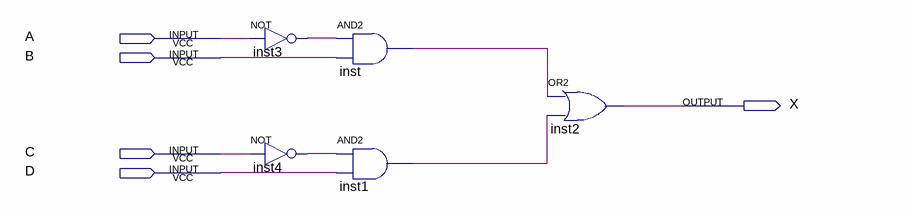
[diagram p0: schematic sheet]
// Quartus schematic Boolean2.bdf as structural Verilog: 5 symbols, 5 pins
module Boolean2 (
  input  A,
  input  B,
  input  C,
  input  D,
  output X
);

  wire inst1_out, inst3_out, inst4_out, inst_out;

  not inst3 (inst3_out, A);
  not inst4 (inst4_out, C);
  and inst (inst_out, inst3_out, B);
  and inst1 (inst1_out, inst4_out, D);
  or inst2 (X, inst_out, inst1_out);
endmodule
